# Altium project dctr.PrjPCB
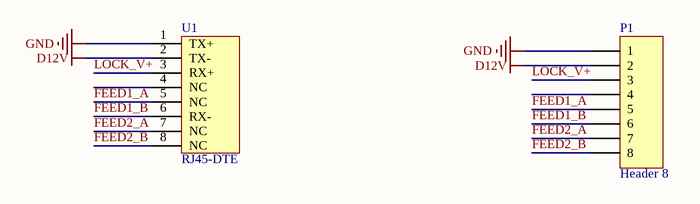
[diagram p0: IO.SchDoc]
1 sheet, 2 parts. Net scope: global (net labels, ports and power ports of the same name join across sheets).
Board file: door_connect.PcbDoc

## Sheet IO.SchDoc
size A4

### Parts
P1  Header 8  [KF142R-5.08-8]
U1  RJ45-DTE  [RJ45]

### Nets
D12V: P1.2 U1.2(TX-)
GND: P1.1 U1.1(TX+)
FEED1_A: P1.5 U1.5(NC)
FEED1_B: P1.6 U1.6(RX-)
FEED2_A: P1.7 U1.7(NC)
FEED2_B: P1.8 U1.8(NC)
LOCK_V+: P1.3 U1.3(RX+)

Not connected (* = marked no-connect by the designer): P1 4; U1 4(NC)

### Library data of the parts
P1 = Header 8: Header, 8-Pin; LatestRevisionDate: 17-Jul-2002; LatestRevisionNote: Re-released for DXP Platform.; Publisher: Altium Limited